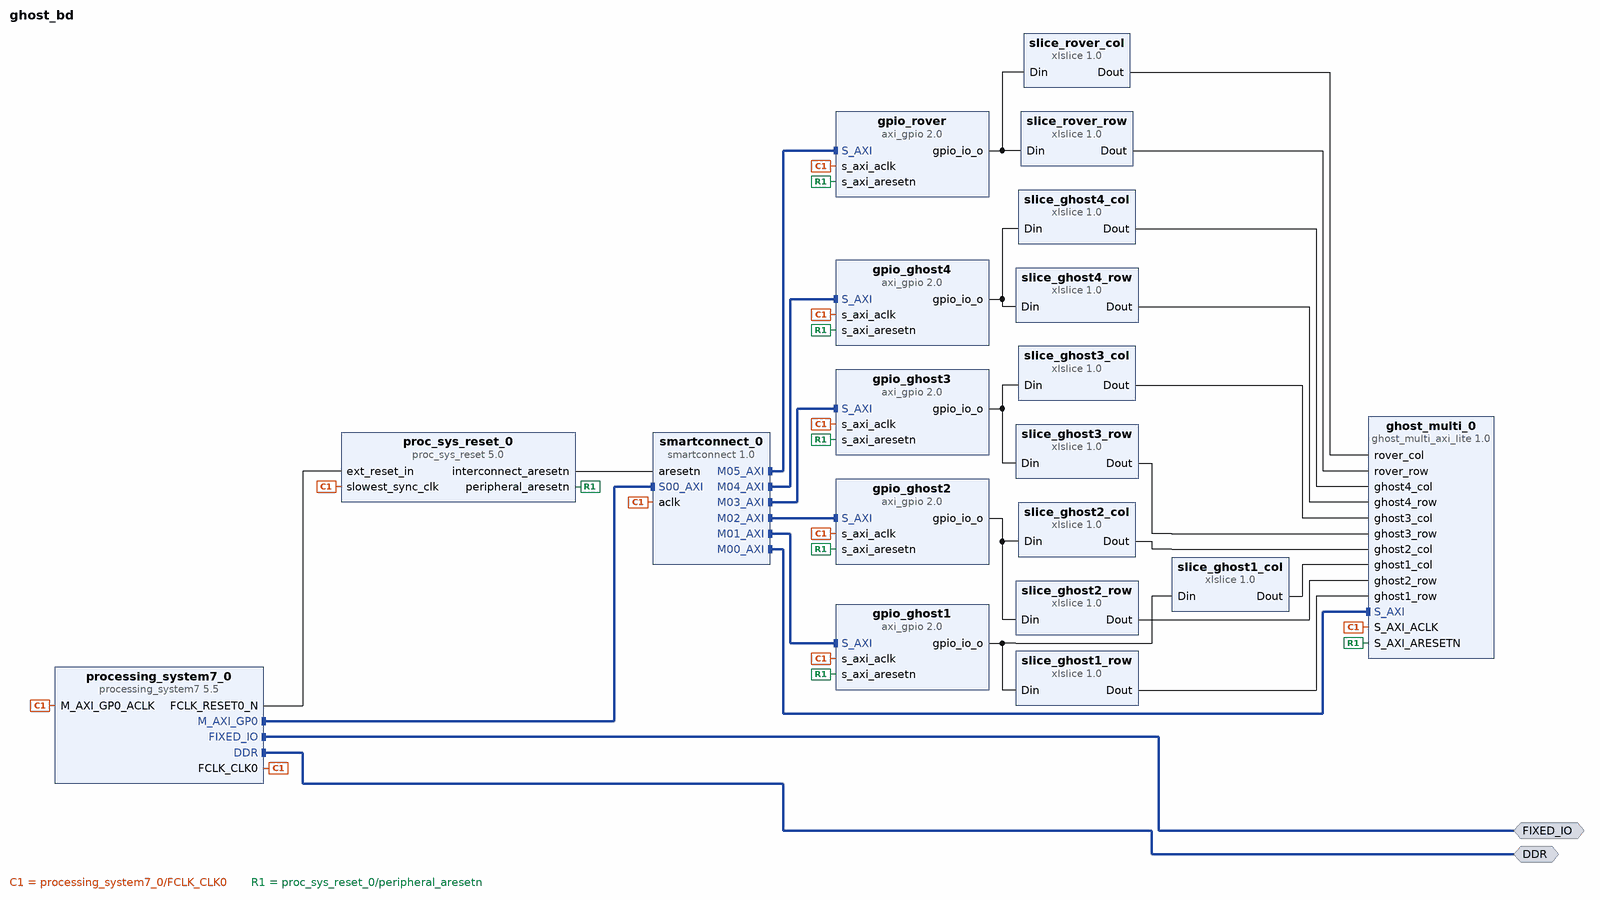
[diagram p0: block diagram of the top level]
# Vivado block design ghost_bd, xc7z020clg400-1, Vivado 2020.2
create_bd_design ghost_bd

create_bd_intf_port -mode Master -vlnv xilinx.com:interface:ddrx_rtl:1.0 DDR
create_bd_intf_port -mode Master -vlnv xilinx.com:display_processing_system7:fixedio_rtl:1.0 FIXED_IO

create_bd_cell -type ip -vlnv xilinx.com:ip:processing_system7:5.5 processing_system7_0
set_property -dict [list \
  CONFIG.PCW_M_AXI_GP0_ENABLE_STATIC_REMAP 1 \
  CONFIG.PCW_M_AXI_GP0_THREAD_ID_WIDTH 6 \
] [get_bd_cells processing_system7_0]
# 2 more settings of processing_system7_0 are not shown: defaults, MIO pin electricals, DDR timing, and values the tool derives
create_bd_cell -type ip -vlnv xilinx.com:ip:proc_sys_reset:5.0 proc_sys_reset_0
create_bd_cell -type ip -vlnv xilinx.com:ip:smartconnect:1.0 smartconnect_0
set_property -dict {CONFIG.NUM_MI 6 CONFIG.NUM_SI 1} [get_bd_cells smartconnect_0]
create_bd_cell -type ip -vlnv user.org:user:ghost_multi_axi_lite:1.0 ghost_multi_0
create_bd_cell -type ip -vlnv xilinx.com:ip:axi_gpio:2.0 gpio_ghost1
set_property -dict {CONFIG.C_ALL_OUTPUTS 1 CONFIG.C_GPIO_WIDTH 8} [get_bd_cells gpio_ghost1]
create_bd_cell -type ip -vlnv xilinx.com:ip:axi_gpio:2.0 gpio_ghost2
set_property -dict {CONFIG.C_ALL_OUTPUTS 1 CONFIG.C_GPIO_WIDTH 8} [get_bd_cells gpio_ghost2]
create_bd_cell -type ip -vlnv xilinx.com:ip:axi_gpio:2.0 gpio_ghost3
set_property -dict {CONFIG.C_ALL_OUTPUTS 1 CONFIG.C_GPIO_WIDTH 8} [get_bd_cells gpio_ghost3]
create_bd_cell -type ip -vlnv xilinx.com:ip:axi_gpio:2.0 gpio_ghost4
set_property -dict {CONFIG.C_ALL_OUTPUTS 1 CONFIG.C_GPIO_WIDTH 8} [get_bd_cells gpio_ghost4]
create_bd_cell -type ip -vlnv xilinx.com:ip:axi_gpio:2.0 gpio_rover
set_property -dict {CONFIG.C_ALL_OUTPUTS 1 CONFIG.C_GPIO_WIDTH 8} [get_bd_cells gpio_rover]
create_bd_cell -type ip -vlnv xilinx.com:ip:xlslice:1.0 slice_ghost1_row
set_property -dict {CONFIG.DIN_FROM 3 CONFIG.DIN_TO 0 CONFIG.DIN_WIDTH 8} [get_bd_cells slice_ghost1_row]
create_bd_cell -type ip -vlnv xilinx.com:ip:xlslice:1.0 slice_ghost1_col
set_property -dict {CONFIG.DIN_FROM 7 CONFIG.DIN_TO 4 CONFIG.DIN_WIDTH 8} [get_bd_cells slice_ghost1_col]
create_bd_cell -type ip -vlnv xilinx.com:ip:xlslice:1.0 slice_ghost2_row
set_property -dict {CONFIG.DIN_FROM 3 CONFIG.DIN_TO 0 CONFIG.DIN_WIDTH 8} [get_bd_cells slice_ghost2_row]
create_bd_cell -type ip -vlnv xilinx.com:ip:xlslice:1.0 slice_ghost2_col
set_property -dict {CONFIG.DIN_FROM 7 CONFIG.DIN_TO 4 CONFIG.DIN_WIDTH 8} [get_bd_cells slice_ghost2_col]
create_bd_cell -type ip -vlnv xilinx.com:ip:xlslice:1.0 slice_ghost3_row
set_property -dict {CONFIG.DIN_FROM 3 CONFIG.DIN_TO 0 CONFIG.DIN_WIDTH 8} [get_bd_cells slice_ghost3_row]
create_bd_cell -type ip -vlnv xilinx.com:ip:xlslice:1.0 slice_ghost3_col
set_property -dict {CONFIG.DIN_FROM 7 CONFIG.DIN_TO 4 CONFIG.DIN_WIDTH 8} [get_bd_cells slice_ghost3_col]
create_bd_cell -type ip -vlnv xilinx.com:ip:xlslice:1.0 slice_ghost4_row
set_property -dict {CONFIG.DIN_FROM 3 CONFIG.DIN_TO 0 CONFIG.DIN_WIDTH 8} [get_bd_cells slice_ghost4_row]
create_bd_cell -type ip -vlnv xilinx.com:ip:xlslice:1.0 slice_ghost4_col
set_property -dict {CONFIG.DIN_FROM 7 CONFIG.DIN_TO 4 CONFIG.DIN_WIDTH 8} [get_bd_cells slice_ghost4_col]
create_bd_cell -type ip -vlnv xilinx.com:ip:xlslice:1.0 slice_rover_row
set_property -dict {CONFIG.DIN_FROM 3 CONFIG.DIN_TO 0 CONFIG.DIN_WIDTH 8} [get_bd_cells slice_rover_row]
create_bd_cell -type ip -vlnv xilinx.com:ip:xlslice:1.0 slice_rover_col
set_property -dict {CONFIG.DIN_FROM 7 CONFIG.DIN_TO 4 CONFIG.DIN_WIDTH 8} [get_bd_cells slice_rover_col]

# ---- connections ----

connect_bd_intf_net [get_bd_intf_pins processing_system7_0/M_AXI_GP0] [get_bd_intf_pins smartconnect_0/S00_AXI]
connect_bd_intf_net [get_bd_intf_pins smartconnect_0/M03_AXI] [get_bd_intf_pins gpio_ghost3/S_AXI]
connect_bd_intf_net [get_bd_intf_pins smartconnect_0/M02_AXI] [get_bd_intf_pins gpio_ghost2/S_AXI]
connect_bd_intf_net [get_bd_intf_pins smartconnect_0/M01_AXI] [get_bd_intf_pins gpio_ghost1/S_AXI]
connect_bd_intf_net [get_bd_intf_pins smartconnect_0/M05_AXI] [get_bd_intf_pins gpio_rover/S_AXI]
connect_bd_intf_net [get_bd_intf_pins smartconnect_0/M00_AXI] [get_bd_intf_pins ghost_multi_0/S_AXI]
connect_bd_intf_net [get_bd_intf_pins smartconnect_0/M04_AXI] [get_bd_intf_pins gpio_ghost4/S_AXI]
connect_bd_intf_net [get_bd_intf_ports FIXED_IO] [get_bd_intf_pins processing_system7_0/FIXED_IO]
connect_bd_intf_net [get_bd_intf_ports DDR] [get_bd_intf_pins processing_system7_0/DDR]
connect_bd_net [get_bd_pins processing_system7_0/FCLK_CLK0] \
  [get_bd_pins processing_system7_0/M_AXI_GP0_ACLK] [get_bd_pins smartconnect_0/aclk] \
  [get_bd_pins proc_sys_reset_0/slowest_sync_clk] [get_bd_pins ghost_multi_0/S_AXI_ACLK] [get_bd_pins gpio_ghost1/s_axi_aclk] \
  [get_bd_pins gpio_ghost2/s_axi_aclk] [get_bd_pins gpio_ghost3/s_axi_aclk] [get_bd_pins gpio_ghost4/s_axi_aclk] \
  [get_bd_pins gpio_rover/s_axi_aclk]
connect_bd_net [get_bd_pins processing_system7_0/FCLK_RESET0_N] [get_bd_pins proc_sys_reset_0/ext_reset_in]
connect_bd_net [get_bd_pins proc_sys_reset_0/interconnect_aresetn] [get_bd_pins smartconnect_0/aresetn]
connect_bd_net [get_bd_pins proc_sys_reset_0/peripheral_aresetn] \
  [get_bd_pins ghost_multi_0/S_AXI_ARESETN] [get_bd_pins gpio_ghost1/s_axi_aresetn] [get_bd_pins gpio_ghost2/s_axi_aresetn] \
  [get_bd_pins gpio_ghost3/s_axi_aresetn] [get_bd_pins gpio_ghost4/s_axi_aresetn] [get_bd_pins gpio_rover/s_axi_aresetn]
connect_bd_net [get_bd_pins gpio_ghost1/gpio_io_o] [get_bd_pins slice_ghost1_row/Din] [get_bd_pins slice_ghost1_col/Din]
connect_bd_net [get_bd_pins slice_ghost1_row/Dout] [get_bd_pins ghost_multi_0/ghost1_row]
connect_bd_net [get_bd_pins slice_ghost1_col/Dout] [get_bd_pins ghost_multi_0/ghost1_col]
connect_bd_net [get_bd_pins gpio_ghost2/gpio_io_o] [get_bd_pins slice_ghost2_row/Din] [get_bd_pins slice_ghost2_col/Din]
connect_bd_net [get_bd_pins slice_ghost2_row/Dout] [get_bd_pins ghost_multi_0/ghost2_row]
connect_bd_net [get_bd_pins slice_ghost2_col/Dout] [get_bd_pins ghost_multi_0/ghost2_col]
connect_bd_net [get_bd_pins gpio_ghost3/gpio_io_o] [get_bd_pins slice_ghost3_row/Din] [get_bd_pins slice_ghost3_col/Din]
connect_bd_net [get_bd_pins slice_ghost3_row/Dout] [get_bd_pins ghost_multi_0/ghost3_row]
connect_bd_net [get_bd_pins slice_ghost3_col/Dout] [get_bd_pins ghost_multi_0/ghost3_col]
connect_bd_net [get_bd_pins gpio_ghost4/gpio_io_o] [get_bd_pins slice_ghost4_row/Din] [get_bd_pins slice_ghost4_col/Din]
connect_bd_net [get_bd_pins slice_ghost4_row/Dout] [get_bd_pins ghost_multi_0/ghost4_row]
connect_bd_net [get_bd_pins slice_ghost4_col/Dout] [get_bd_pins ghost_multi_0/ghost4_col]
connect_bd_net [get_bd_pins gpio_rover/gpio_io_o] [get_bd_pins slice_rover_row/Din] [get_bd_pins slice_rover_col/Din]
connect_bd_net [get_bd_pins slice_rover_row/Dout] [get_bd_pins ghost_multi_0/rover_row]
connect_bd_net [get_bd_pins slice_rover_col/Dout] [get_bd_pins ghost_multi_0/rover_col]

# ---- address map ----
assign_bd_address -offset 0x41200000 -range 64K -target_address_space [get_bd_addr_spaces processing_system7_0/Data] [get_bd_addr_segs gpio_ghost1/S_AXI/Reg]
assign_bd_address -offset 0x41210000 -range 64K -target_address_space [get_bd_addr_spaces processing_system7_0/Data] [get_bd_addr_segs gpio_ghost2/S_AXI/Reg]
assign_bd_address -offset 0x41220000 -range 64K -target_address_space [get_bd_addr_spaces processing_system7_0/Data] [get_bd_addr_segs gpio_ghost3/S_AXI/Reg]
assign_bd_address -offset 0x41230000 -range 64K -target_address_space [get_bd_addr_spaces processing_system7_0/Data] [get_bd_addr_segs gpio_ghost4/S_AXI/Reg]
assign_bd_address -offset 0x41240000 -range 64K -target_address_space [get_bd_addr_spaces processing_system7_0/Data] [get_bd_addr_segs gpio_rover/S_AXI/Reg]
assign_bd_address -offset 0x43C00000 -range 64K -target_address_space [get_bd_addr_spaces processing_system7_0/Data] [get_bd_addr_segs ghost_multi_0/S_AXI/axi_lite]
assign_bd_address -offset 0x43C10000 -range 64K -target_address_space [get_bd_addr_spaces processing_system7_0/Data] [get_bd_addr_segs ghost_multi_0/S_AXI/reg0]

validate_bd_design
save_bd_design
